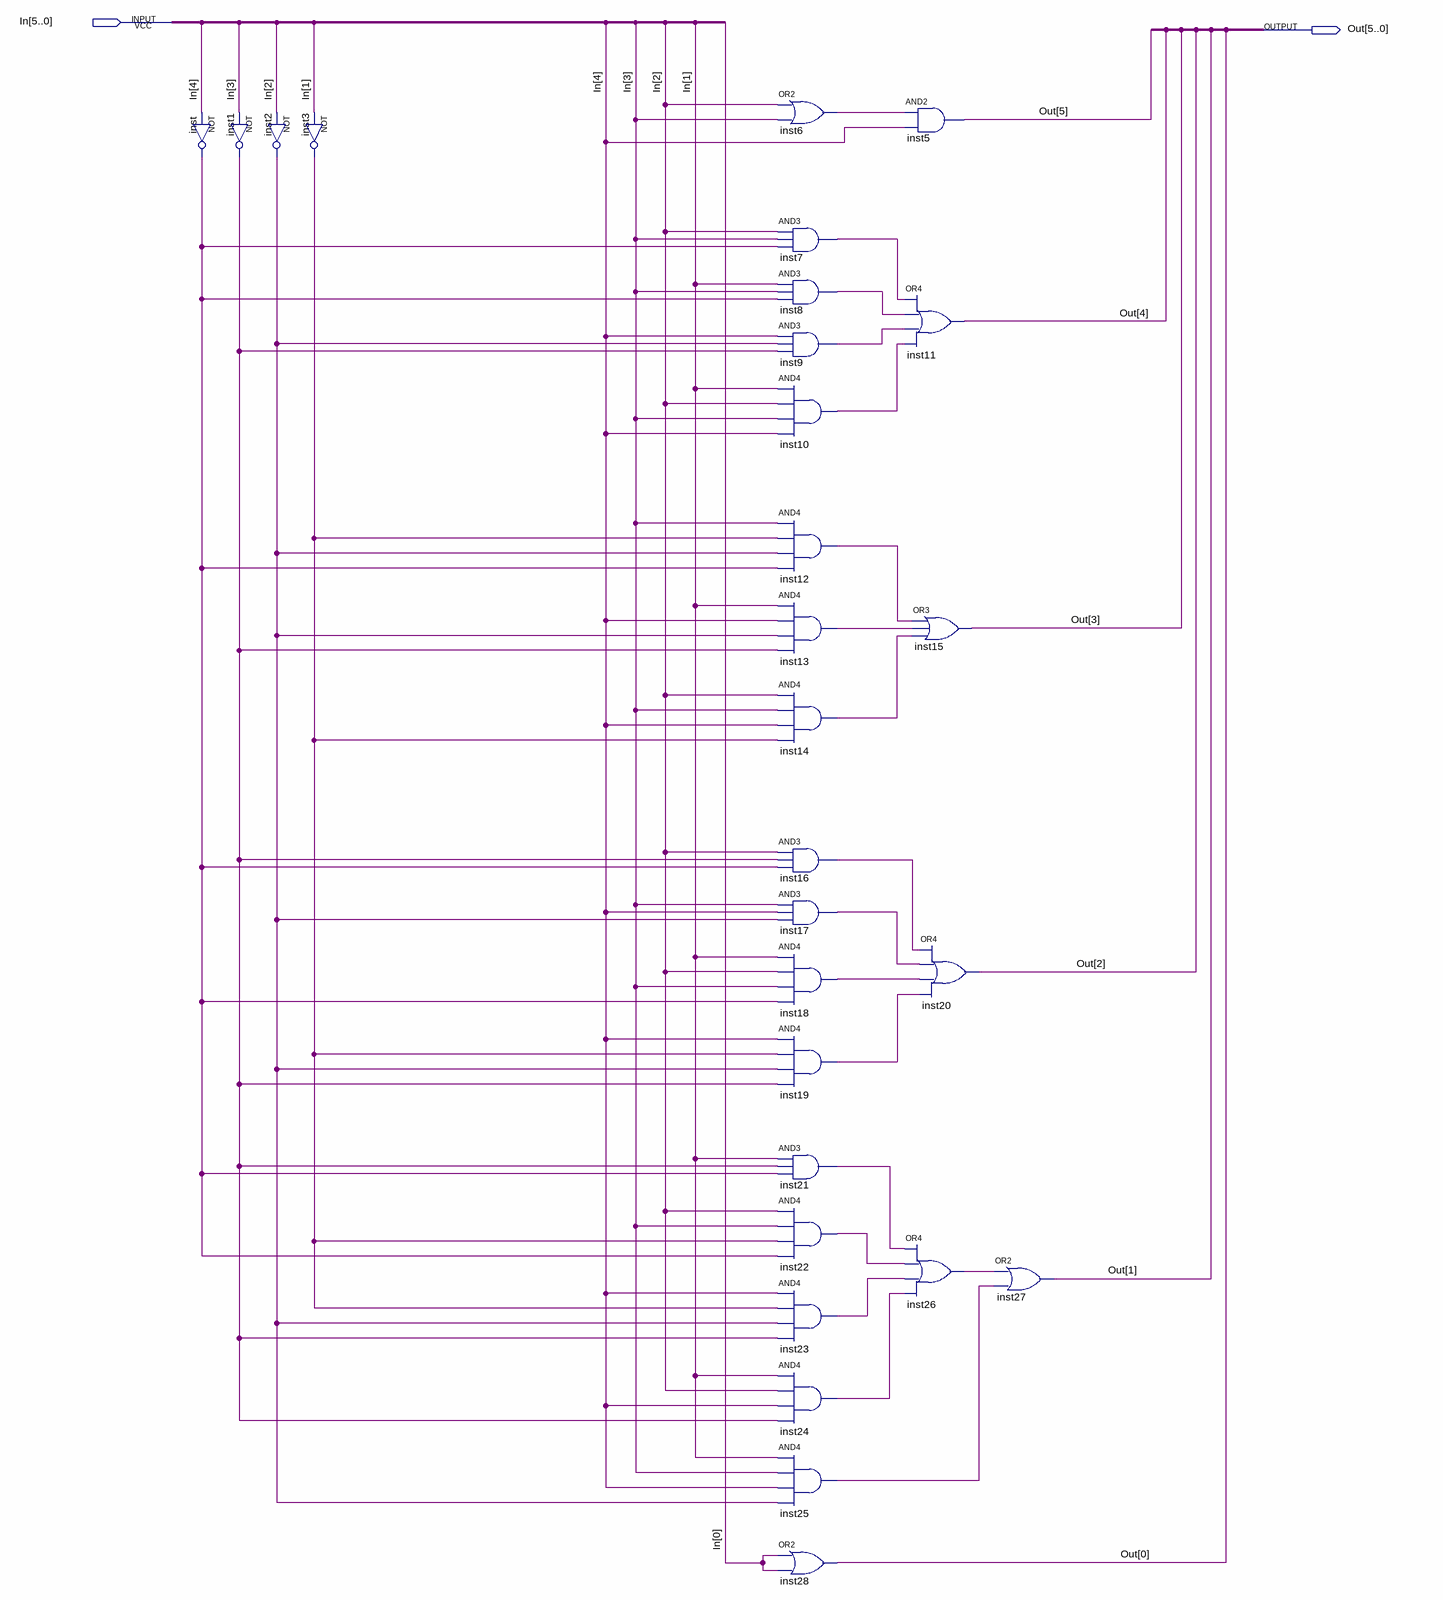
[diagram p0: schematic sheet]
// Quartus schematic output_binary_bcd.bdf as structural Verilog: 28 symbols, 2 pins
module output_binary_bcd (
  input  [5:0] In,
  output [5:0] Out
);

  wire inst1_out, inst2_out, inst3_out, inst6_out, inst7_out, inst8_out, inst9_out, inst10_out, inst12_out,
       inst13_out, inst14_out, inst16_out, inst17_out, inst18_out, inst19_out, inst21_out, inst22_out,
       inst23_out, inst24_out, inst25_out, inst26_out, inst_out;

  not inst (inst_out, In[4]);
  not inst1 (inst1_out, In[3]);
  not inst2 (inst2_out, In[2]);
  not inst3 (inst3_out, In[1]);
  or inst6 (inst6_out, In[2], In[3]);
  and inst7 (inst7_out, In[2], In[3], inst_out);
  and inst8 (inst8_out, In[1], In[3], inst_out);
  and inst9 (inst9_out, In[4], inst2_out, inst1_out);
  and inst10 (inst10_out, In[1], In[2], In[3], In[4]);
  and inst12 (inst12_out, In[3], inst3_out, inst2_out, inst_out);
  and inst13 (inst13_out, In[1], In[4], inst2_out, inst1_out);
  and inst14 (inst14_out, In[2], In[3], In[4], inst3_out);
  and inst16 (inst16_out, In[2], inst1_out, inst_out);
  and inst17 (inst17_out, In[3], In[4], inst2_out);
  and inst18 (inst18_out, In[1], In[2], In[3], inst_out);
  and inst19 (inst19_out, In[4], inst3_out, inst2_out, inst1_out);
  and inst21 (inst21_out, In[1], inst1_out, inst_out);
  and inst22 (inst22_out, In[2], In[3], inst3_out, inst_out);
  and inst23 (inst23_out, In[4], inst3_out, inst2_out, inst1_out);
  and inst24 (inst24_out, In[1], In[2], In[4], inst1_out);
  and inst25 (inst25_out, In[1], In[3], In[4], inst2_out);
  or inst28 (Out[0], In[0], In[0]);
  and inst5 (Out[5], inst6_out, In[4]);
  or inst11 (Out[4], inst7_out, inst8_out, inst9_out, inst10_out);
  or inst15 (Out[3], inst12_out, inst13_out, inst14_out);
  or inst20 (Out[2], inst16_out, inst17_out, inst18_out, inst19_out);
  or inst26 (inst26_out, inst21_out, inst22_out, inst23_out, inst24_out);
  or inst27 (Out[1], inst26_out, inst25_out);
endmodule
